# Altium schematic sheet MCU.SchDoc
size A4; SheetNumber: 5; SheetTotal: 7
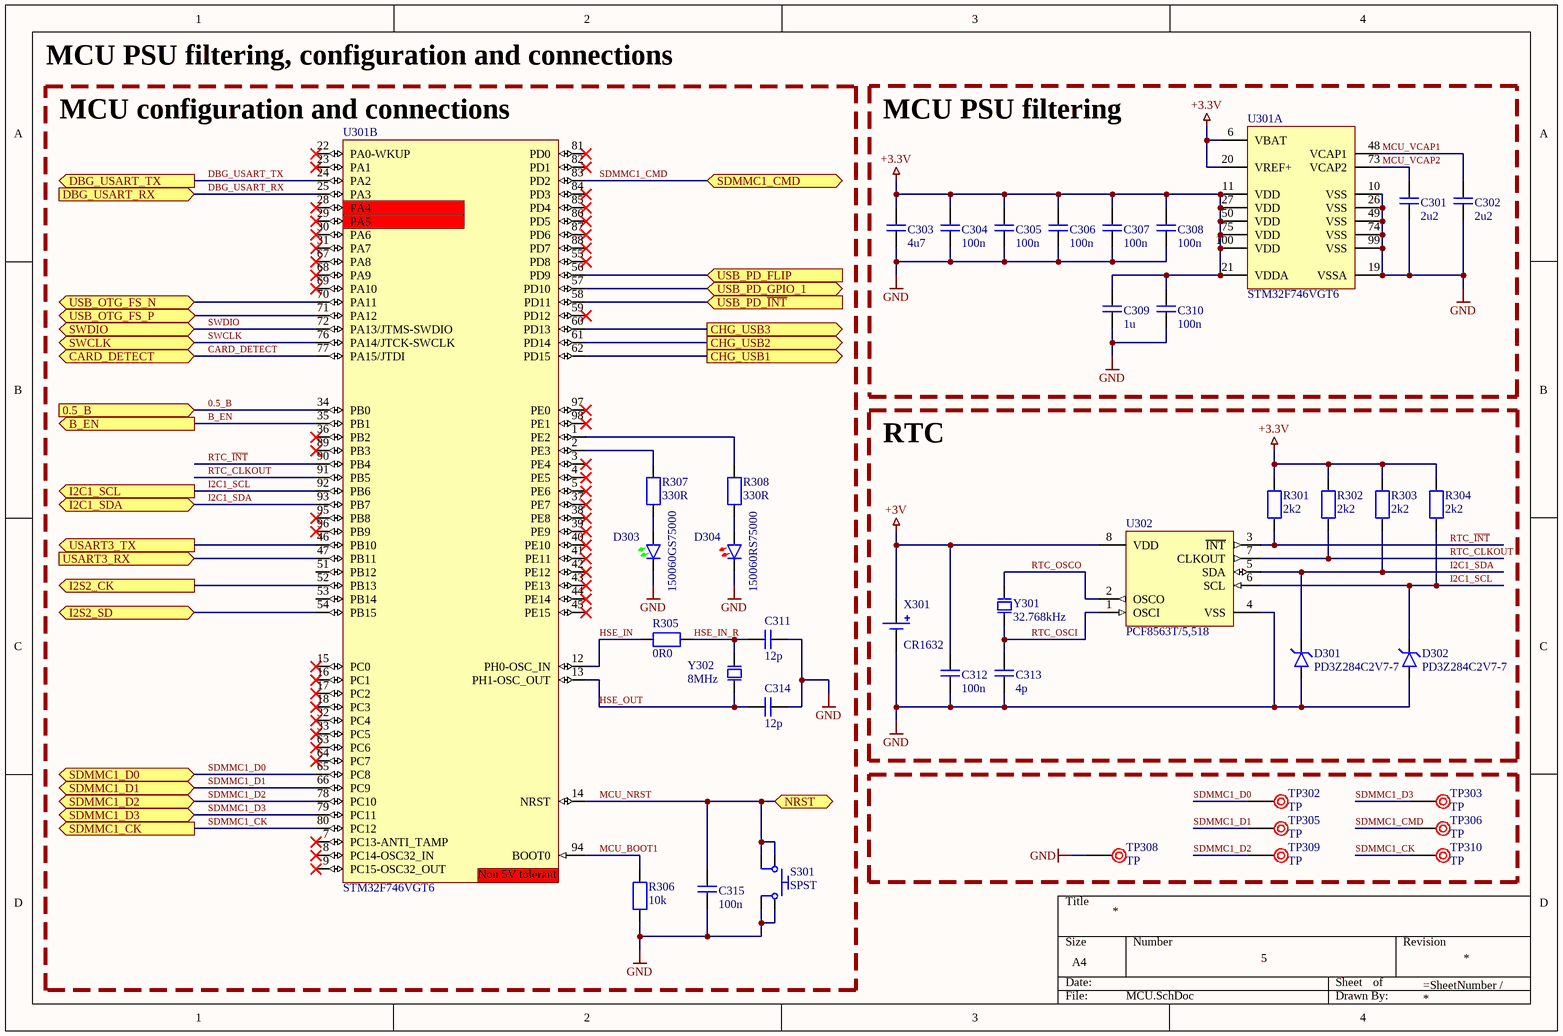
[diagram p0: MCU.SchDoc]

## Parts
C301  2u2  [CAPC0603]
C302  2u2  [CAPC0603]
C303  4u7  [CAPC0603]
C304  100n  [CAPC0603]
C305  100n  [CAPC0603]
C306  100n  [CAPC0603]
C307  100n  [CAPC0603]
C308  100n  [CAPC0603]
C309  1u  [CAPC0603]
C310  100n  [CAPC0603]
C311  12p  [CAPC0603]
C312  100n  [CAPC0603]
C313  4p  [CAPC0603]
C314  12p  [CAPC0603]
C315  100n  [CAPC0603]
D301  PD3Z284C2V7-7  [PowerDI323]
D302  PD3Z284C2V7-7  [PowerDI323]
D303  150060GS75000  [LED0603]
D304  150060RS75000  [LED0603]
R301  2k2  [RESC0603]
R302  2k2  [RESC0603]
R303  2k2  [RESC0603]
R304  2k2  [RESC0603]
R305  0R0  [RESC0603]
R306  10k  [RESC0603]
R307  330R  [RESC0603]
R308  330R  [RESC0603]
S301  SPST  [SW_TSA063G60-250]
TP302  TP  [TESTPOINT]
TP303  TP  [TESTPOINT]
TP305  TP  [TESTPOINT]
TP306  TP  [TESTPOINT]
TP308  TP  [TESTPOINT]
TP309  TP  [TESTPOINT]
TP310  TP  [TESTPOINT]
U301  STM32F746VGT6  [QFP50P1600X1600X160-100]  (parts A,B of 2)
U302  PCF8563T/5,518  [SOIC127P610X175-8]
X301  CR1632  [BAT_504TR]
Y301  32.768kHz  [XTAL320X150X80]
Y302  8MHz  [XTAL800X450X180]

## Blocks framed on the sheet
MCU PSU filtering: C301-C310 U301
RTC: C312 C313 D301 D302 R301-R304 U302 X301 Y301

## Ports
0.5_B (in, see POWER[3D]), B_EN (out, see POWER[3D]), CARD_DETECT (bidir, see CONN[3B]), CHG_USB1 (out, see POWER[1C]), CHG_USB2 (out, see POWER[1C]), CHG_USB3 (out, see POWER[1C]), DBG_USART_RX (in, see CONN[4B]), DBG_USART_TX (out, see CONN[4B]), I2C1_SCL (out, see USB[4C]), I2C1_SDA (bidir, see USB[4C]), I2S2_CK (out, see CONN[1C]), I2S2_SD (bidir, see CONN[1C]), NRST (bidir, see CONN[4A], WIRELESS[1B]), SDMMC1_CK (out, see CONN[3B]), SDMMC1_CMD (bidir, see CONN[3B]), SDMMC1_D0 (bidir, see CONN[3B]), SDMMC1_D1 (bidir, see CONN[3B]), SDMMC1_D2 (bidir, see CONN[3B]), SDMMC1_D3 (bidir, see CONN[3B]), SWCLK (bidir, see CONN[4A]), SWDIO (bidir, see CONN[4A]), USART3_RX (in, see WIRELESS[2B]), USART3_TX (out, see WIRELESS[2B]), USB_OTG_FS_N (bidir, see USB[1C]), USB_OTG_FS_P (bidir, see USB[1C]), USB_PD_FLIP (in, see USB[4C]), USB_PD_GPIO_1 (bidir, see USB[4C]), USB_PD_~{INT} (in, see USB[4C])

## Nets
+3.3V: C303.2 C304.2 C305.2 C306.2 C307.2 C308.2 C309.2 C310.2 R301.2 R302.2 R303.2 R304.2 U301.6(VBAT) U301.11(VDD) U301.20(VREF+) U301.21(VDDA) U301.27(VDD) U301.50(VDD) U301.75(VDD) U301.100(VDD)
+3V: C312.2 U302.8(VDD) X301.1(P)
GND: C301.1 C302.1 C303.1 C304.1 C305.1 C306.1 C307.1 C308.1 C309.1 C310.1 C311.2 C312.1 C313.1 C314.2 C315.1 D301.2 D302.2 D303.1 D304.1 R306.1 S301.3 S301.4 TP308.1 U301.10(VSS) U301.19(VSSA) U301.26(VSS) U301.49(VSS) U301.74(VSS) U301.99(VSS) U302.4(VSS) X301.2(N)
0.5_B: U301.34(PB0) ; port 0.5_B
B_EN: U301.35(PB1) ; port B_EN
CARD_DETECT: U301.77(PA15/JTDI) ; port CARD_DETECT
CHG_USB1: U301.62(PD15) ; port CHG_USB1
CHG_USB2: U301.61(PD14) ; port CHG_USB2
CHG_USB3: U301.60(PD13) ; port CHG_USB3
DBG_USART_RX: U301.25(PA3) ; port DBG_USART_RX
DBG_USART_TX: U301.24(PA2) ; port DBG_USART_TX
HSE_IN: R305.2 U301.12(PH0-OSC_IN)
HSE_IN_R: C311.1 R305.1 Y302.2
HSE_OUT: C314.1 U301.13(PH1-OSC_OUT) Y302.1
I2C1_SCL: D302.1 R304.1 U301.92(PB6) U302.6(SCL) ; port I2C1_SCL
I2C1_SDA: D301.1 R303.1 U301.93(PB7) U302.5(SDA) ; port I2C1_SDA
I2S2_CK: U301.52(PB13) ; port I2S2_CK
I2S2_SD: U301.54(PB15) ; port I2S2_SD
MCU_BOOT1: R306.2 U301.94(BOOT0)
MCU_NRST: C315.2 S301.1 S301.2 U301.14(NRST) ; port NRST
MCU_VCAP1: C302.2 U301.48(VCAP1)
MCU_VCAP2: C301.2 U301.73(VCAP2)
RTC_CLKOUT: R302.1 U301.91(PB5) U302.7(CLKOUT)
RTC_~{INT}: R301.1 U301.90(PB4) U302.3(~{INT})
RTC_OSCI: C313.2 U302.1(OSCI) Y301.1
RTC_OSCO: U302.2(OSCO) Y301.2
SDMMC1_CK: TP310.1 U301.80(PC12) ; port SDMMC1_CK
SDMMC1_CMD: TP306.1 U301.83(PD2) ; port SDMMC1_CMD
SDMMC1_D0: TP302.1 U301.65(PC8) ; port SDMMC1_D0
SDMMC1_D1: TP305.1 U301.66(PC9) ; port SDMMC1_D1
SDMMC1_D2: TP309.1 U301.78(PC10) ; port SDMMC1_D2
SDMMC1_D3: TP303.1 U301.79(PC11) ; port SDMMC1_D3
SWCLK: U301.76(PA14/JTCK-SWCLK) ; port SWCLK
SWDIO: U301.72(PA13/JTMS-SWDIO) ; port SWDIO
USART3_RX: U301.47(PB11) ; port USART3_RX
USART3_TX: U301.46(PB10) ; port USART3_TX
USB_OTG_FS_N: U301.70(PA11) ; port USB_OTG_FS_N
USB_OTG_FS_P: U301.71(PA12) ; port USB_OTG_FS_P
USB_PD_FLIP: U301.56(PD9) ; port USB_PD_FLIP
USB_PD_GPIO_1: U301.57(PD10) ; port USB_PD_GPIO_1
USB_PD_~{INT}: U301.58(PD11) ; port USB_PD_~{INT}
NetD303_2: D303.2 R307.1
NetD304_2: D304.2 R308.1
NetR307_2: R307.2 U301.2(PE3)
NetR308_2: R308.2 U301.1(PE2)

Not connected (* = marked no-connect by the designer): U301 3(PE4)* 4(PE5)* 5(PE6)* 7(PC13-ANTI_TAMP)* 8(PC14-OSC32_IN)* 9(PC15-OSC32_OUT)* 15(PC0)* 16(PC1)* 17(PC2)* 18(PC3)* 22(PA0-WKUP)* 23(PA1)* 28(PA4)* 29(PA5)* 30(PA6)* 31(PA7)* 32(PC4)* 33(PC5)* 36(PB2)* 37(PE7)* 38(PE8)* 39(PE9)* 40(PE10)* 41(PE11)* 42(PE12)* 43(PE13)* 44(PE14)* 45(PE15)* 51(PB12) 53(PB14) 55(PD8)* 59(PD12)* 63(PC6)* 64(PC7)* 67(PA8)* 68(PA9)* 69(PA10)* 81(PD0)* 82(PD1)* 84(PD3)* 85(PD4)* 86(PD5)* 87(PD6)* 88(PD7)* 89(PB3)* 95(PB8)* 96(PB9)* 97(PE0)* 98(PE1)*

## Notes on the sheet
- MCU PSU filtering, configuration and connections
- (near U301) MCU configuration and connections
- (in symbol STM32F746VGT6, part B) Non 5V tolerant

## Library data of the parts
C301-C315 = CAPC0603: Ceramic capacitor, VAL?,  VOL?, DIEL?; Checked: Yes; MFR: ?; Supplier: Digi-Key; SPN: ?; MFRN: ?; LCSC Part Number: ?
  C301 C302: Value: 2u2
  C303: Value: 4u7
  C304-C308 C310 C312 C315: Value: 100n
  C309: Value: 1u
  C311 C314: Footprint: 0603; Value: 12p
  C313: Footprint: 0603; Value: 4p
D301 D302 = PD3Z284C2V7-7: Zener Dioode, 2.7V, 500mW; MFR: Diodes Incorporated; SPN: PD3Z284C2V7DITR-ND; Checked: Yes; Supplier: Digi-Key; MFRN: PD3Z284C2V7-7; Value: PD3Z284C2V7-7; LCSC Part Number: C531171
D303 = LTST-C194KGKT: LED Green, 2.1V, 20mA; MFR: Würth Elektronik; SPN: 732-4971-2-ND; Checked: Yes; Supplier: Digi-Key; MFRN: 150060GS75000; Value: Green; LCSC Part Number: C913102
D304 = HL-PST-1608S9AC-04: LED Red, 2.3V, 20mA; MFR: Würth Elektronik; SPN: 732-4978-2-ND; Checked: Yes; Supplier: Digi-Key; MFRN: 150060RS75000; Value: RED; LCSC Part Number: C497931
R301-R308 = RES0603: Thick film resistor, VAL?, POW?; Checked: Yes; MFR: ?; Supplier: Digi-Key; SPN: ?; MFRN: ?; LCSC Part Number: ?
  R301-R304: Value: 2k2
  R305: Value: 0R0
  R306: Value: 10k
  R307 R308: Value: 330R
S301 = TACT SW: TACT SW, SPST, NO; MFR: C&K; MFRN: PTS 647 SN50 SMTR2 LFS; SPN: PTS647SN50SMTR2LFSTR-ND; Value: PTS 647 SN50 SMTR2 LFS; Checked: Yes; Supplier: Digi-Key; LCSC Part Number: C294566
TP302 TP303 TP305 TP306 TP308-TP310 = TESTPOINT: MFR: Keystone; MFRN: 5001; SPN: 36-5001-ND; Value: 5001; Checked: Yes; Supplier: Digi-Key; LCSC Part Number: C238122
U301 = STM32F746VGT6: High-performance and DSP with FPU, Arm Cortex-M7 MCU with 1 Mbyte of Flash memory, 216 MHz CPU, Art Accelerator, L1 cache, SDRAM, TFT; MFR: STMicroelectronics; SPN: 497-15819-ND; Checked: Yes; Supplier: Digi-Key; MFRN: STM32F746VGT6; Value: STM32F746VGT6; LCSC Part Number: C87664
U302 = PCF8563T/5,518: IC RTC CLOCK/CALENDAR I2C 8SO; MFR: NXP USA Inc.; SPN: 568-6650-2-ND; Checked: Yes; Supplier: Digi-Key; MFRN: PCF8563T/5,518; Value: PCF8563T/5,518; LCSC Part Number: C7440
X301 = CR1632: CR1632 Battery Holder; MFR: Keystone Electronics; MFRN: 504TR; SPN: 36-504TR-ND; Value: 504TR; Checked: Yes; Supplier: Digi-Key; LCSC Part Number: C964735
Y301 = X1A0001410002: Crystal, 32.768Hz, 9pF, 50kOhms; MFR: Seiko Epson; SPN: SER4072TR-ND; Checked: Yes; Supplier: Digi-Key; MFRN: X1A0001410002; Value: 32.768kHz; LCSC Part Number: C1987155
Y302 = NX8045GB-8.000000MHZ: Crystal, 8MHz, 8pF, 200Ohms; MFR: NDK; SPN: 644-LNCF001-8MTR-ND; Checked: Yes; Supplier: Digi-Key; MFRN: NX8045GB-8.000000MHZ; Value: 8MHz; LCSC Part Number: C1985641